# EAGLE design main (EAGLE 9.1.1)
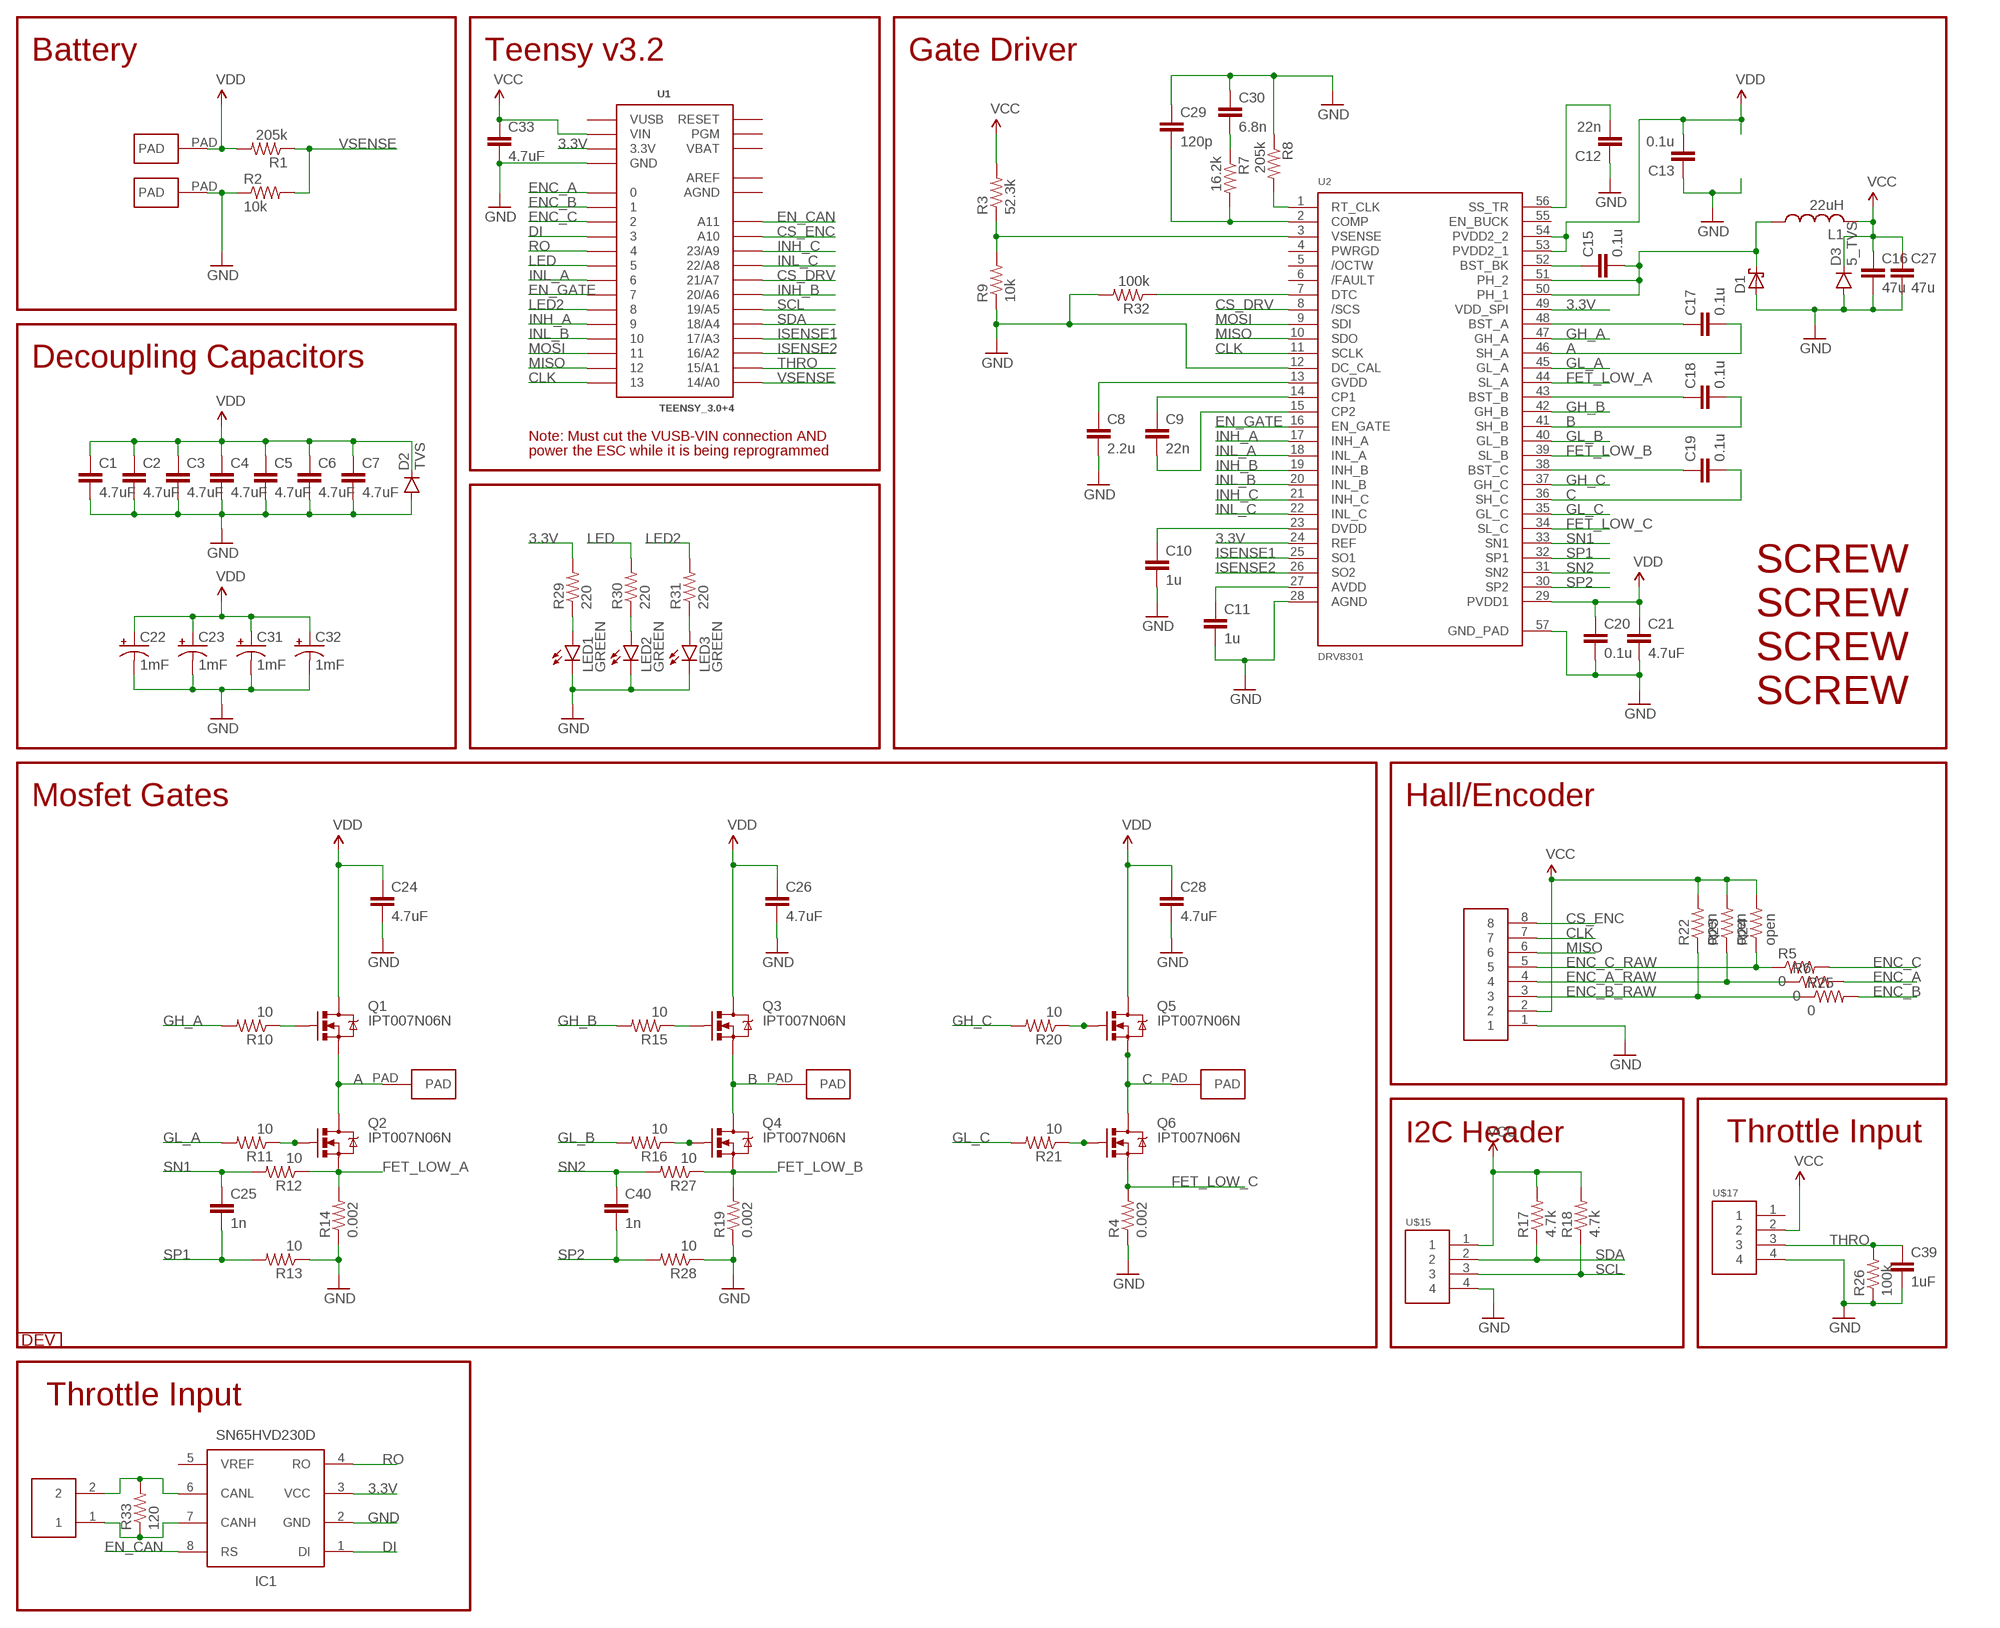
[diagram p0: schematic, sheet 1]

## Parts
C1  4.7uF  CAP1206  [1206]
C2  4.7uF  CAP1206  [1206]
C3  4.7uF  CAP1206  [1206]
C4  4.7uF  CAP1206  [1206]
C5  4.7uF  CAP1206  [1206]
C6  4.7uF  CAP1206  [1206]
C7  4.7uF  CAP1206  [1206]
C8  2.2u  CAP0603-CAP  [0603-CAP]
C9  22n  CAP0603-CAP  [0603-CAP]
C10  1u  CAP0603-CAP  [0603-CAP]
C11  1u  CAP0603-CAP  [0603-CAP]
C12  22n  CAP0603-CAP  [0603-CAP]
C13  0.1u  CAP0603-CAP  [0603-CAP]
C15  0.1u  CAP0603-CAP  [0603-CAP]
C16  47u  CAP0805  [0805]
C17  0.1u  CAP0603-CAP  [0603-CAP]
C18  0.1u  CAP0603-CAP  [0603-CAP]
C19  0.1u  CAP0603-CAP  [0603-CAP]
C20  0.1u  CAP0603-CAP  [0603-CAP]
C21  4.7uF  CAP1206  [1206]
C22  1mF  CAP_POLPTH4  [CPOL-RADIAL-1000UF-25V]
C23  1mF  CAP_POLPTH4  [CPOL-RADIAL-1000UF-25V]
C24  4.7uF  CAP1206  [1206]
C25  1n  CAP0603-CAP  [0603-CAP]
C26  4.7uF  CAP1206  [1206]
C27  47u  CAP0805  [0805]
C28  4.7uF  CAP1206  [1206]
C29  120p  CAP0603-CAP  [0603-CAP]
C30  6.8n  CAP0603-CAP  [0603-CAP]
C31  1mF  CAP_POLPTH4  [CPOL-RADIAL-1000UF-25V]
C32  1mF  CAP_POLPTH4  [CPOL-RADIAL-1000UF-25V]
C33  4.7uF  CAP1206  [1206]
C39  1uF  CAP0603-CAP  [0603-CAP]
C40  1n  CAP0603-CAP  [0603-CAP]
CAN  HEADER2  [2PINVALULOK]
D1  SCHOTTKY_SMA  [SMA]
D2  TVS  DIODEES3J  [SMC]
D3  5_TVS  DIODESOT23  [SOT23-3]
IC1  SN65HVD230D  [SO-8]
L1  22uH  L-USL5650M  [L5650M]
LED1  GREEN  LED1206  [LED-1206]
LED2  GREEN  LED1206  [LED-1206]
LED3  GREEN  LED1206  [LED-1206]
Q1  IPT007N06N  MOSFET-NCHANNELPG-HSOF-8-1  [PG-HSOF-8-1]
Q2  IPT007N06N  MOSFET-NCHANNELPG-HSOF-8-1  [PG-HSOF-8-1]
Q3  IPT007N06N  MOSFET-NCHANNELPG-HSOF-8-1  [PG-HSOF-8-1]
Q4  IPT007N06N  MOSFET-NCHANNELPG-HSOF-8-1  [PG-HSOF-8-1]
Q5  IPT007N06N  MOSFET-NCHANNELPG-HSOF-8-1  [PG-HSOF-8-1]
Q6  IPT007N06N  MOSFET-NCHANNELPG-HSOF-8-1  [PG-HSOF-8-1]
R1  205k  RESISTOR0603-RES  [0603-RES]
R2  10k  RESISTOR0603-RES  [0603-RES]
R3  52.3k  RESISTOR0603-RES  [0603-RES]
R4  0.002  RESISTOR2512  [R2512]
R5  0  RESISTOR0603-RES  [0603-RES]
R6  0  RESISTOR0603-RES  [0603-RES]
R7  16.2k  RESISTOR0603-RES  [0603-RES]
R8  205k  RESISTOR0603-RES  [0603-RES]
R9  10k  RESISTOR0603-RES  [0603-RES]
R10  10  RESISTOR0603-RES  [0603-RES]
R11  10  RESISTOR0603-RES  [0603-RES]
R12  10  RESISTOR0603-RES  [0603-RES]
R13  10  RESISTOR0603-RES  [0603-RES]
R14  0.002  RESISTOR2512  [R2512]
R15  10  RESISTOR0603-RES  [0603-RES]
R16  10  RESISTOR0603-RES  [0603-RES]
R17  4.7k  RESISTOR0603-RES  [0603-RES]
R18  4.7k  RESISTOR0603-RES  [0603-RES]
R19  0.002  RESISTOR2512  [R2512]
R20  10  RESISTOR0603-RES  [0603-RES]
R21  10  RESISTOR0603-RES  [0603-RES]
R22  open  RESISTOR0603-RES  [0603-RES]
R23  open  RESISTOR0603-RES  [0603-RES]
R24  open  RESISTOR0603-RES  [0603-RES]
R25  0  RESISTOR0603-RES  [0603-RES]
R26  100k  RESISTOR0603-RES  [0603-RES]
R27  10  RESISTOR0603-RES  [0603-RES]
R28  10  RESISTOR0603-RES  [0603-RES]
R29  220  RESISTOR0603-RES  [0603-RES]
R30  220  RESISTOR0603-RES  [0603-RES]
R31  220  RESISTOR0603-RES  [0603-RES]
R32  100k  RESISTOR0603-RES  [0603-RES]
R33  120  RESISTOR0603-RES  [0603-RES]
U1  TEENSY_3.0+4  [TEENSY_3.0+4]
U2  DRV8301  [DRV8301]
U$2  HEADER8  [8PINVALULOK]
U$15  HEADER4VALULOK  [4PINVALULOK]
U$16  DEV  [DEV]
U$17  HEADER4VALULOK  [4PINVALULOK]
U$19  SCREW  [M3HOLE]
U$20  SCREW  [M3HOLE]
U$21  SCREW  [M3HOLE]
U$22  SCREW  [M3HOLE]
U$23  PAD  [PAD]
U$24  PAD  [PAD]
U$25  PAD  [PAD]
U$26  PAD  [PAD]
U$27  PAD  [PAD]

## Nets
3.3V: IC1.3(VCC) R29.2 U1.3.3V U1.3.3V1(3.3V) U2.24(REF) U2.49(VDD_SPI)
A: C17.2 Q1.S Q2.D U2.46(SH_A) U$23.PAD
B: C18.2 Q3.S Q4.D U2.41(SH_B) U$24.PAD
C: C19.2 Q5.S Q6.D U2.36(SH_C) U$25.PAD
CANH: CAN.1 IC1.7(CANH) R33.1
CANL: CAN.2 IC1.6(CANL) R33.2
CLK: U1.13 U2.11(SCLK) U$2.7
CS_DRV: U1.21/A7 U2.8(/SCS)
CS_ENC: U1.A10 U$2.8
DI: IC1.1(DI) U1.3
EN_CAN: IC1.8(RS) U1.A11
EN_GATE: U1.7 U2.16(EN_GATE)
ENC_A: R6.2 U1.0
ENC_A_RAW: R6.1 R23.1 U$2.4
ENC_B: R25.2 U1.1
ENC_B_RAW: R22.1 R25.1 U$2.3
ENC_C: R5.2 U1.2
ENC_C_RAW: R5.1 R24.1 U$2.5
FET_LOW_A: Q2.S R12.1 R14.2 U2.44(SL_A)
FET_LOW_B: Q4.S R19.2 R27.1 U2.39(SL_B)
FET_LOW_C: Q6.S R4.2 U2.34(SL_C)
GH_A: R10.2 U2.47(GH_A)
GH_B: R15.2 U2.42(GH_B)
GH_C: R20.2 U2.37(GH_C)
GL_A: R11.2 U2.45(GL_A)
GL_A': Q2.G R11.1
GL_B: R16.2 U2.40(GL_B)
GL_B': Q4.G R16.1
GL_C: R21.2 U2.35(GL_C)
GL_C': Q6.G R21.1
GND: C1.2 C2.2 C3.2 C4.2 C5.2 C6.2 C7.2 C8.2 C10.2 C11.2 C12.1 C13.1 C16.2 C20.2 C21.2 C22.- C23.- C24.2 C26.2 C27.2 C28.2 C29.1 C30.1 C31.- C32.- C33.2 C39.2 D1.A D2.A D3.1(A) IC1.2(GND) LED1.C LED2.C LED3.C R2.1 R4.1 R8.1 R9.1 R13.1 R14.1 R19.1 R26.1 R28.1 R32.2 U1.GND U1.GND1(GND) U2.12(DC_CAL) U2.28(AGND) U2.57(GND_PAD) U$2.1 U$15.4 U$17.4 U$27.PAD
INH_A: U1.9 U2.17(INH_A)
INH_B: U1.20/A6 U2.19(INH_B)
INH_C: U1.23/A9 U2.21(INH_C)
INL_A: U1.6 U2.18(INL_A)
INL_B: U1.10 U2.20(INL_B)
INL_C: U1.22/A8 U2.22(INL_C)
ISENSE1: U1.17/A3 U2.25(SO1)
ISENSE2: U1.16/A2 U2.26(SO2)
LED: R30.2 U1.5
LED2: R31.2 U1.8
MISO: U1.12 U2.10(SDO) U$2.6
MOSI: U1.11 U2.9(SDI)
N$1: Q3.G R15.1
N$2: R3.1 R9.2 U2.3(VSENSE)
N$3: C29.2 R7.2 U2.2(COMP)
N$4: C10.1 U2.23(DVDD)
N$5: Q5.G R20.1
N$6: C12.2 U2.56(SS_TR)
N$7: C30.2 R7.1
N$8: C15.1 U2.52(BST_BK)
N$9: Q1.G R10.1
N$10: R8.2 U2.1(RT_CLK)
N$11: LED1.A R29.1
N$12: R32.1 U2.7(DTC)
N$16: LED2.A R30.1
N$17: LED3.A R31.1
N$28: C19.1 U2.38(BST_C)
N$30: C9.1 U2.14(CP1)
N$31: C11.1 U2.27(AVDD)
N$32: C9.2 U2.15(CP2)
N$33: C8.1 U2.13(GVDD)
N$34: C18.1 U2.43(BST_B)
N$44: C17.1 U2.48(BST_A)
N$47: C15.2 D1.C L1.1 U2.50(PH_1) U2.51(PH_2)
RO: IC1.4(RO) U1.4
SCL: R18.1 U1.19/A5 U$15.3
SDA: R17.1 U1.18/A4 U$15.2
SN1: C25.1 R12.2 U2.33(SN1)
SN2: C40.1 R27.2 U2.31(SN2)
SP1: C25.2 R13.2 U2.32(SP1)
SP2: C40.2 R28.2 U2.30(SP2)
THRO: C39.1 R26.2 U1.15/A1 U$17.3
VCC: C16.1 C27.1 C33.1 D3.3(C) L1.2 R3.2 R17.2 R18.2 R22.2 R23.2 R24.2 U1.VIN U$2.2 U$15.1 U$17.2
VDD: C1.1 C2.1 C3.1 C4.1 C5.1 C6.1 C7.1 C13.2 C20.1 C21.1 C22.+ C23.+ C24.1 C26.1 C28.1 C31.+ C32.+ D2.C Q1.D Q3.D Q5.D R1.2 U2.29(PVDD1) U2.53(PVDD2_1) U2.54(PVDD2_2) U$26.PAD
VSENSE: R1.1 R2.2 U1.14/A0
Unconnected: IC1.5(VREF) U1.PGM U1.RESET U2.4(PWRGD) U2.5(/OCTW) U2.6(/FAULT) U2.55(EN_BUCK) U$17.1

## Notes on the sheet
- Battery | Teensy v3.2 | Gate Driver
- Decoupling Capacitors
- Note: Must cut the VUSB-VIN connection AND
- power the ESC while it is being reprogrammed
- Mosfet Gates | Hall/Encoder
- I2C Header | Throttle Input
- Throttle Input

## Power pins joined to a net without a drawn wire
AGND: U1.AGND
AREF: U1.AREF
VBAT: U1.VBAT
VUSB: U1.VUSB

## Library data of the parts
C1-C7 C10 C11 C16 C21 C24 C26-C28 C33 = SparkFun-Capacitors:CAP: Capacitor Standard 0603 ceramic capacitor, and 0.1" leaded capacitor.
C8 C9 C12 C13 C15 C17-C20 C25 C29 C30 C39 C40 = SparkFun-Passives:CAP: Capacitor Standard 0603 ceramic capacitor, and 0.1" leaded capacitor.
C22 C23 C31 C32 = SparkFun-Capacitors:CAP_POL: Capacitor Polarized These are standard SMD and PTH capacitors. Normally 10uF, 47uF, and 100uF in electrolytic and tantalum varieties. Always verify the external diameter of the through hole cap, it varies with capacity, voltage, and manufacturer. The EIA devices should be standard.
CAN = Custom_old:HEADER2
D1 = sc_usercreated:SCHOTTKY_SMA
D2 = SparkFun-DiscreteSemi:DIODE: Diode These are standard reverse protection diodes and small signal diodes. SMA package can handle up to about 1A. SOD-323 can handle about 200mA. What the SOD-323 package when ordering, there are some mfgs out there that are 5-pin packages.; PROD_ID: DIO-12441; VALUE: 3A/600V
D3 = SparkFun-DiscreteSemi:DIODE: Diode These are standard reverse protection diodes and small signal diodes. SMA package can handle up to about 1A. SOD-323 can handle about 200mA. What the SOD-323 package when ordering, there are some mfgs out there that are 5-pin packages.
IC1 = Misaka-IC:SN65HVD23*D: 3.3V CAN Bus Transceiver Supply voltage: 3...3.6V Max rate: 1Mbps Standby mode(SN65HVD230D) Sleep mode(SN65HVD231D) Slope control mode
L1 = rcl:L-US: INDUCTOR, American symbol; SPICEPREFIX: L
LED1-LED3 = SparkFun-LED:LED: LEDs Standard schematic elements and footprints for 5mm, 3mm, 1206, and 0603 sized LEDs. 5mm - Spark Fun Electronics SKU : COM-00529 (and others)
Q1-Q6 = Custom_old:MOSFET-NCHANNEL: Generic NMOS footprint
R1-R3 R5-R13 R15-R18 R20-R33 = SparkFun-Passives:RESISTOR: Resistor Basic schematic elements and footprints for 0603, 1206, and PTH resistors.
R4 R14 R19 = SparkFun-Resistors:RESISTOR: Resistor Basic schematic elements and footprints for 0603, 1206, and PTH resistors.
U1 = Teensy3.0:TEENSY_3.0+4: Teensy 3.0 board, showing all pins that are easily acessible. See 'AllAnalogPins" and 'AllPins' packages for additional pin holes, as needed. The 'Basic' package has fewer pins.
U2 = F-J:DRV8301
U$2 = Custom_old:HEADER8
U$15 U$17 = Custom_old:HEADER4
U$16 = F-J:DEV
U$19-U$22 = Custom_old:SCREW
U$23-U$27 = Custom_old:PAD

## Board
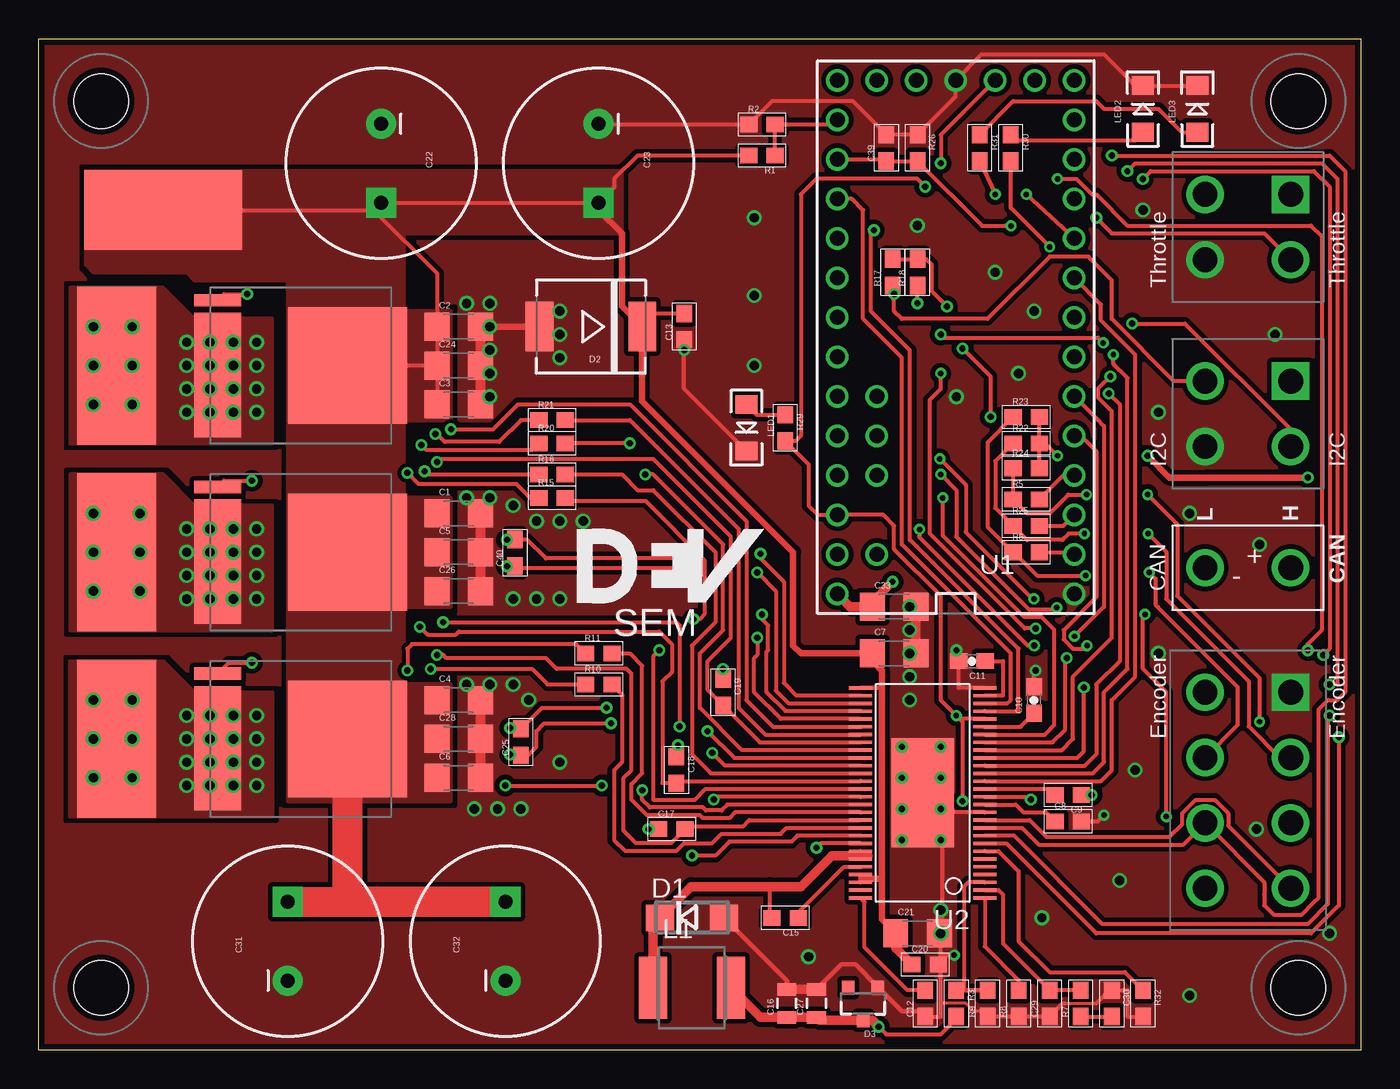
[diagram p1: board, top side]
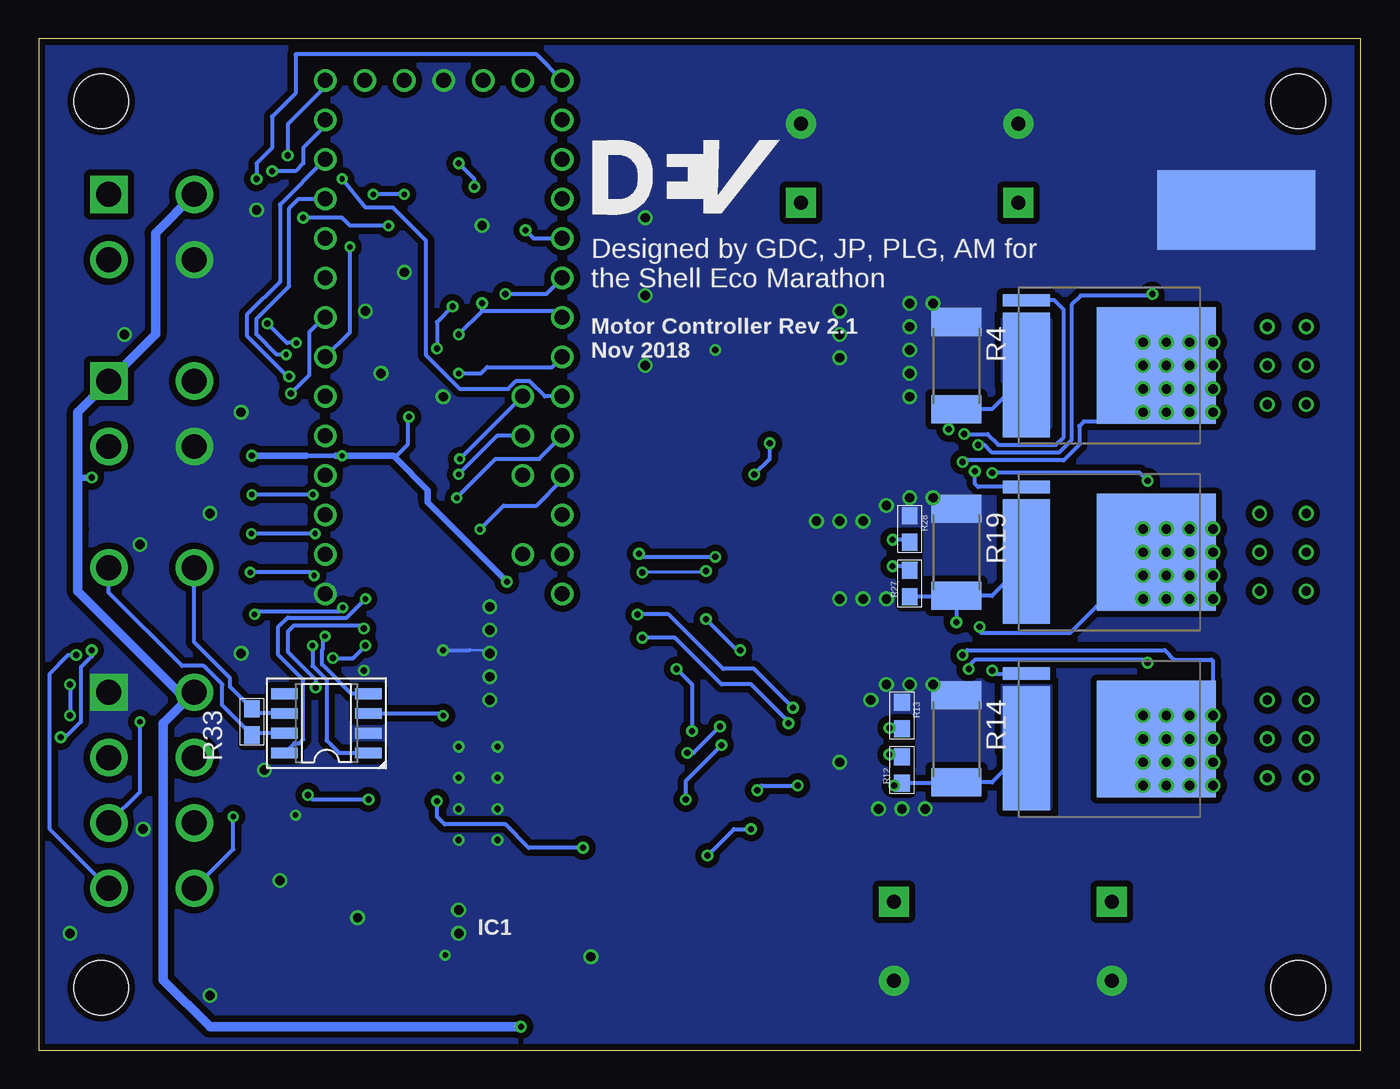
[diagram p2: board, bottom side, seen from below]

Size 85 x 65 mm. Coordinates in mm from the lower left corner, seen from the top.
Outline: 0,0 0,65 85,65 85,0 0,0
Copper layers (1*16): Top 0.0356mm / dielectric 1.5011mm / Bottom 0.0356mm
Design rules "patrick *": minimum track width 6mil, minimum drill 13mil, track to track 6mil, track to pad 6mil, pad to pad 6mil, via to via 6mil, smd to smd 6mil, copper to edge 15mil, drill to drill 6mil, minimum pad ring 7mil, minimum via ring 7mil, stop-mask expansion 3mil, vias tented up to drill 30mil, thermal gap 10mil

### Footprints (pad centres in the part's own frame; a part is rotated, then mirrored left to right if it is on the bottom)
1206 = smd 1.6 x 1.8: 1 -1.4,0; 2 1.4,0
0603-CAP = smd 1.1 x 1: 1 -0.85,0; 2 0.85,0
0805 = smd 0.8 x 1.2: 1 -0.9,0; 2 0.9,0
CPOL-RADIAL-1000UF-25V = drill 0.9 pad 1.93 square: + 2.54,0 | drill 0.9 pad 1.93: - -2.54,0
2PINVALULOK = drill 1.6: 1 0,5.5; 2 0,0
SMA = smd 1.8 x 1.7: A 2.05,0; C -2.05,0
SMC = smd 1.778 x 3.175: A 3.302,0; C -3.302,0
SOT23-3 = smd 0.8 x 0.9: 1 -0.95,-1; 2 0.95,-1; 3 0,1.1
SO-8 = smd 1.7 x 0.7: 1 -2.7,1.905; 2 -2.7,0.635; 3 -2.7,-0.635; 4 -2.7,-1.905; 5 2.7,-1.905; 6 2.7,-0.635; 7 2.7,0.635; 8 2.7,1.905
L5650M = smd 1.8 x 4: 1 -2.5,0; 2 2.5,0
LED-1206 = smd 1.2 x 1.4: A -1.5,0; C 1.5,0
PG-HSOF-8-1 = smd 7.5 x 7.65: D 0,8.855 | smd 0.8 x 3: G -4.2,0.5 | smd 8 x 3: S 0.6,0.5
0603-RES = smd 1.1 x 1: 1 -0.85,0; 2 0.85,0
R2512 = smd 1.8 x 3.2: 1 -2.8,0; 2 2.8,0
TEENSY_3.0+4 = drill 0.965: 0 -7.62,13.97; 1 -7.62,11.43; 2 -7.62,8.89; 3 -7.62,6.35; 3.3V 7.62,11.43; 3.3V1 -2.54,-16.51; 4 -7.62,3.81; 5 -7.62,1.27; 6 -7.62,-1.27; 7 -7.62,-3.81; 8 -7.62,-6.35; 9 -7.62,-8.89; 10 -7.62,-11.43; 11 -7.62,-13.97; 12 -7.62,-16.51; 13 7.62,-16.51; 14/A0 7.62,-13.97; 15/A1 7.62,-11.43; 16/A2 7.62,-8.89; 17/A3 7.62,-6.35; 18/A4 7.62,-3.81; 19/A5 7.62,-1.27; 20/A6 7.62,1.27; 21/A7 7.62,3.81; 22/A8 7.62,6.35; 23/A9 7.62,8.89; A10 5.08,6.35; A11 5.08,3.81; AGND 7.62,13.97; AREF 5.08,8.89; GND -7.62,16.51; GND1 0,-16.51; PGM 2.54,-16.51; RESET 5.08,-16.51; VBAT -5.08,-16.51; VIN 7.62,16.51; VUSB 5.08,13.97
DRV8301 = smd 1.5 x 0.21: 1 -4,6.75; 2 -4,6.25; 3 -4,5.75; 4 -4,5.25; 5 -4,4.75; 6 -4,4.25; 7 -4,3.75; 8 -4,3.25; 9 -4,2.75; 10 -4,2.25; 11 -4,1.75; 12 -4,1.25; 13 -4,0.75; 14 -4,0.25; 15 -4,-0.25; 16 -4,-0.75; 17 -4,-1.25; 18 -4,-1.75; 19 -4,-2.25; 20 -4,-2.75; 21 -4,-3.25; 22 -4,-3.75; 23 -4,-4.25; 24 -4,-4.75; 25 -4,-5.25; 26 -4,-5.75; 27 -4,-6.25; 28 -4,-6.75; 29 4,-6.75; 30 4,-6.25; 31 4,-5.75; 32 4,-5.25; 33 4,-4.75; 34 4,-4.25; 35 4,-3.75; 36 4,-3.25; 37 4,-2.75; 38 4,-2.25; 39 4,-1.75; 40 4,-1.25; 41 4,-0.75; 42 4,-0.25; 43 4,0.25; 44 4,0.75; 45 4,1.25; 46 4,1.75; 47 4,2.25; 48 4,2.75; 49 4,3.25; 50 4,3.75; 51 4,4.25; 52 4,4.75; 53 4,5.25; 54 4,5.75; 55 4,6.25; 56 4,6.75 | smd 4 x 7: 57 0,0
8PINVALULOK = drill 1.6 square: 1 0,5.5 | drill 1.6: 2 0,0; 3 4.2,5.5; 4 4.2,0; 5 8.4,5.5; 6 8.4,0; 7 12.6,5.5; 8 12.6,0
4PINVALULOK = drill 1.6 square: 1 0,5.5 | drill 1.6: 2 0,0; 3 4.2,5.5; 4 4.2,0
M3HOLE = hole 3.5: 0,0
PAD = smd 10.16 x 5.08: PAD 0,0

### Placement (x,y rotation side)
C1  27,34.5 0 top
C2  27,46.5 0 top
C3  27,41.5 0 top
C4  27,22.5 0 top
C5  27,32 0 top
C6  27,17.5 0 top
C7  55,25.5 0 top
C8  66.2,14.7 0 top
C9  66.2,16.4 180 top
C10  64,22.5 90 top
C11  60,25 180 top
C12  57,3 90 top
C13  41.5,46.5 90 top
C15  48,8.5 180 top
C16  48.1,3 90 top
C17  40.7,14.2 0 top
C18  41,18 270 top
C19  44,23 270 top
C20  57,5.5 0 top
C21  56.5,7.5 0 top
C22  22,57 270 top
C23  36,57 270 top
C24  27,44 0 top
C25  31,19.8 90 top
C26  27,29.5 0 top
C27  50,3 90 top
C28  27,20 0 top
C29  65,3 90 top
C30  69,3 270 top
C31  16,7 90 top
C32  30,7 90 top
C33  55,28.5 0 top
C39  54.5,58 90 top
C40  30.62,31.97 90 top
CAN  75,31 270 top
D1  42,8.5 0 top
D2  35.5,46.5 180 top
D3  53,3 180 top
IC1  66.5,21 180 bottom
L1  42,4 0 top
LED1  45.5,40 270 top
LED2  71,60.5 90 top
LED3  74.5,60.5 90 top
Q1  11,20 270 top
Q2  22,20 270 bottom
Q3  11,32 270 top
Q4  22,32 270 bottom
Q5  11,44 270 top
Q6  22,44 270 bottom
R1  46.5,57.5 180 top
R2  46.5,59.5 0 top
R3  59,3 270 top
R4  26,44 270 bottom
R5  63.5,35.4 0 top
R6  63.5,32 0 top
R7  67,3 90 top
R8  63,3 90 top
R9  61,3 90 top
R10  36,23.5 0 top
R11  36,25.5 0 top
R12  29.5,18 90 bottom
R13  29.5,21.5 270 bottom
R14  26,20 270 bottom
R15  33,35.5 0 top
R16  33,37 0 top
R17  54.9,50 90 top
R18  56.5,50 90 top
R19  26,32 270 bottom
R20  33,39 0 top
R21  33,40.5 0 top
R22  63.5,39 0 top
R23  63.5,40.7 0 top
R24  63.5,37.4 0 top
R25  63.5,33.7 0 top
R26  56.5,58 270 top
R27  29,30 90 bottom
R28  29,33.5 270 bottom
R29  48,40 270 top
R30  62.5,58 270 top
R31  60.5,58 270 top
R32  71,3 270 top
R33  71.3,21.1 90 bottom
U1  58.96,45.83 180 top
U2  56.83,16.53 180 top
U$2  75,23 270 top
U$15  75,43 270 top
U$16  34.65,28.74 0 top
U$17  75,55 270 top
U$19  4,4 0 top
U$20  81,4 0 top
U$21  4,61 0 top
U$22  81,61 0 top
U$23  5,20 90 top
U$24  5,32 90 top
U$25  5,44 90 top
U$26  8,54 0 top
U$27  8,54 0 bottom
U$28  DEV  [DEV]  49.35,53.74 0 bottom

### Tracks (layer width: path | path; a pad name or v marks a point on that pad's centre or on a via)
3.3V  (via drill 0.35, 0.4)
  Top 0.254: U2.24 60.81,21.3 59.2,21.3 | 59.2,21.3 v59,21.5 58,22.5 58,29.2 55,32.2 55,33.7 54.3,34.4 U1.3.3V 50.1,34.4 49.5,35 49.5,37.65 R29.2 48.65,39.15 49,39.5 49,55 50,56 56.5,56 v57,55.5 | 59.2,21.3 59.4,21.1 v59.4,16 | U2.49 50.28,13.28 v50,13 | U1.3.3V1 58,58.84 v58,57
  Bottom 0.254: v50,13 53.5,13 55,14.5 58.9,14.5 59.4,15 v59.4,16 | v58,57 57,56 v57,55.5 | IC1.3 59.13,21.64 | 59.13,21.64 | 59.13,21.64 v59,21.5
A  (via drill 0.4, 0.6)
  Top 0.254: U2.46 45.68,14.78 45.3,14.4 41.75,14.4 C17.2 40.65,13.3 38.4,13.3 37.6,14.1 37.6,17.5 38.1,18 38.1,24.2 37.8,24.5 33.3,24.5 32.6,25.2 26.2,25.2 26,25.4 v25.6,25.4
  Bottom 0.254: v25.6,25.4 25.3,25.7 12.6,25.7 12,25.1 9.6,25.1 9.5,25 v9.5,21.5 | v12.5,20 Q2.D
  other vias: 9.5,20 9.5,18.5 9.5,17 11,17 11,18.5 11,20 11,21.5 12.5,21.5 12.5,18.5 12.5,17 14,17 14,18.5 14,20 14,21.5 3.5,20 6,20 6,17.5 3.5,17.5 3.5,22.5 6,22.5
  pour Top (isolate 0.254, no thermals): 2,15 2,25 8,25 10,23 15,23 15,15
B  (via drill 0.4, 0.6)
  Top 0.254: U2.41 41.35,17.28 41.22,17.15 C18.2 40.1,17.15 40.1,23.7 40.7,24.3 40.7,26.1 39.9,26.9 27,26.9 26.8,26.7 25,26.7 v24.5,27.2
  Bottom 0.254: v14,29 14.5,28.5 17,28.5 18.7,26.8 24.4,26.8 24.5,26.9 v24.5,27.2 | v12.5,32 Q4.D
  other vias: 9.5,33.5 9.5,32 9.5,30.5 9.5,29 11,29 11,30.5 11,32 11,33.5 12.5,33.5 12.5,30.5 12.5,29 14,30.5 14,32 14,33.5 3.5,34.5 3.5,32 3.5,29.5 6.5,29.5 6.5,32 6.5,34.5
  pour Top (isolate 0.254, no thermals): 2,37 2,27 15,27 15,35 10,35 8,37
C  (via drill 0.4, 0.6)
  Top 0.254: U2.36 46.37,19.78 C19.2 43,23.15 43,25 44.5,26.5 44.5,33 39.5,38 25.8,38 v25.6,37.8
  Bottom 0.254: v14,44 14,43.2 16.8,40.4 17.8,40.4 18.1,40.1 18.1,38.9 19.1,37.9 25.4,37.9 25.5,37.8 v25.6,37.8 | v12.5,44 Q6.D
  other vias: 9.5,45.5 9.5,44 9.5,42.5 9.5,41 11,41 11,42.5 11,44 11,45.5 12.5,45.5 12.5,42.5 14,42.5 14,41 12.5,41 14,45.5 3.5,44 6,44 6,46.5 3.5,46.5 3.5,41.5 6,41.5
  pour Top (isolate 0.254, no thermals): 2,49 2,39 15,39 15,47 10,47 8,49
CANH
  Bottom 0.254: IC1.7 71.19,20.36 R33.1 73.2,22.15 73.2,23.5 74.4,24.7 75.8,24.7 80.5,29.4 CAN.1
CANL
  Bottom 0.254: IC1.6 70.98,21.64 R33.2 72.7,23.35 72.7,23.9 75,26.2 CAN.2
CLK  (via drill 0.4)
  Top 0.254: v71,56 71.5,56.5 82,56.5 83,55.5 83,25.8 v82.6,25.4 | U2.11 63.72,14.78 64.8,13.7 72.7,13.7 73.52,14.52 73.52,15.21 74.39,16.08 75.61,16.08 76.48,15.21 76.48,14.42 U$2.7
  Bottom 0.254: U1.13 53,64 68.5,64 68.5,61.5 70,60 70,58 71,57 v71,56 | U$2.7 84.3,14.2 84.3,24.2 83.1,25.4 v82.6,25.4
CS_DRV  (via drill 0.35, 0.4)
  Top 0.254: U2.8 62.22,13.28 68,7.5 81.8,7.5 83.6,9.3 v83.6,20.1 | v65.5,56 66.72,56 67.72,55 68,55 70,53 81.8,53 82.5,52.3 82.5,27 81.6,26.1 v81.6,25.7
  Bottom 0.254: U1.21/A7 52.46,42.02 53.47,43.02 54.3,43.02 54.82,42.5 57.93,42.5 60.1,44.67 60.1,52.03 62.23,54.16 63.98,54.16 v65.5,56 | v81.6,25.7 81.6,25.3 82.3,24.6 82.3,21.1 83.3,20.1 v83.6,20.1
CS_ENC  (via drill 0.35)
  Top 0.254: v58,37 59,36 59,33 63.7,28.3 65.33,28.3 v65.46,28.43 | v72.5,15 72.5,23 71,24.5 71,27.87 v71.13,28
  Bottom 0.254: U1.A10 55.52,39.48 v58,37 | U$2.8 72.5,12.9 v72.5,15 | v71.13,28 70.93,28.21 65.67,28.21 65.46,28.42 v65.46,28.43
DI  (via drill 0.35)
  Top 0.254: U1.3 67.02,39.48 68,38.5 68,29.1 65.9,27 65.9,26.4 66.5,25.8 67.2,25.8 v67.4,26
  Bottom 0.254: v67.4,26 67.4,24.7 66.5,23.8 66.5,19.9 65.69,19.09 IC1.1
EN_CAN  (via drill 0.35)
  Top 0.254: v57.93,38 59.6,36.33 59.6,33.3 63.9,29 v64,29
  Bottom 0.254: U1.A11 57.9,38 v57.93,38 | IC1.8 68.56,19.74 68.23,19.74 68,19.97 68,23.8 69.6,25.4 69.6,27.2 69,27.8 65.2,27.8 v64,29
EN_GATE
  Top 0.254: U2.16 68.28,17.28 69,18 69,22.5 70.5,24 70.5,44.7 68.3,46.9 68.3,47.92 U1.7
ENC_A
  Top 0.254: R6.2 66.44,32 U1.0
ENC_A_RAW  (via drill 0.35)
  Top 0.254: R23.1 61,39.05 61,33.65 R6.1 62.7,32 64.2,30.5 v67.3,30.5 | U$2.4 77.09,20.89 77.09,23.33 71.96,28.46 71.8,28.62 71.8,30.3 v71.4,30.7
  Bottom 0.254: v71.4,30.7 67.5,30.7 v67.3,30.5
ENC_B
  Top 0.254: R25.2 65.88,33.7 U1.1
ENC_B_RAW  (via drill 0.35)
  Top 0.254: R22.1 61.5,37.85 61.5,34.85 | 61.5,34.85 R25.1 | U$2.3 79.8,18.8 77.8,20.8 77.8,23.7 72.5,29 72.5,32.03 v71.33,33.2 | 61.5,34.85 63.55,32.8 65.83,32.8 66.23,33.2 v67.23,33.2
  Bottom 0.254: v67.23,33.2 v71.33,33.2
ENC_C
  Top 0.254: R5.2 65.89,36.94 U1.2
ENC_C_RAW  (via drill 0.35)
  Top 0.254: R24.1 62.65,36.5 R5.1 63.55,34.5 65,34.5 66.2,35.7 v67.37,35.7 | v78.5,21.1 78.5,23.9 73.2,29.2 73.2,33.8 v71.3,35.7
  Bottom 0.254: U$2.5 78.5,16.6 v78.5,21.1 | v67.37,35.7 v71.3,35.7
FET_LOW_A  (via drill 0.4)
  Top 0.254: U2.44 44.28,15.78 43.9,15.4 42.9,15.4 42.7,15.6 39.3,15.6 38.8,16.1 v38.8,16.7 | v30,17 v36.2,17
  Bottom 0.254: v38.8,16.7 38.5,17 v36.2,17 | Q2.S 23.7,17.2 R14.2 26.05,17.15 R12.1 29.65,17 v30,17
  pour Bottom (isolate 0.254, no thermals): 20,23.5 20,15.5 23,19.5 23,23.5
FET_LOW_B  (via drill 0.4)
  Top 0.254: U2.39 44.12,18.28 v43.3,19.1 | v26,27.5 41,27.5 41.2,27.3 v41.2,20.8
  Bottom 0.254: v43.3,19.1 42.9,19.1 v41.2,20.8 | R19.2 v26,27.5 | Q4.S 23.7,29.2 R19.2 | R19.2 26.05,29.15 R27.1
FET_LOW_C  (via drill 0.4)
  Top 0.254: v26.5,39.9 29.2,39.9 30.8,41.5 38,41.5 45.5,34 45.5,22.5 47.22,20.78 U2.34
  Bottom 0.254: Q6.S 23.7,41.2 R4.2 26.5,40.7 v26.5,39.9
  pour Bottom (isolate 0.254, no thermals): 20,47 20,40 23,43 23,47
GH_A
  Top 0.254: R10.2 37.5,22.85 37.5,18.5 37,18 37,13.5 37.7,12.8 41,12.8 41.5,13.3 43.3,13.3 43.9,13.9 47.7,13.9 48.08,14.28 U2.47
GH_B  (via drill 0.4)
  Top 0.254: R15.2 34.05,35.3 39,35.3 42.8,31.5 42.8,28 42.5,27.7 v42.1,27.7 | v39.9,25.7 39.5,25.3 39.5,16.1 42.2,16.1 42.88,16.78 U2.42
  Bottom 0.254: v42.1,27.7 40.1,25.7 v39.9,25.7
GH_C  (via drill 0.4)
  Top 0.254: U2.37 45.22,19.28 42.5,22 42.5,25.5 44,27 44,32.5 39.5,37 v39,37 | v38,39 R20.2
  Bottom 0.254: v39,37 38,38 v38,39
GL_A
  Top 0.254: U2.45 44.78,15.28 44.4,14.9 42.7,14.9 42.5,15.1 39.1,15.1 38.1,16.1 38.1,17.1 38.8,17.8 38.8,24.7 38,25.5 R11.2
GL_A'  (via drill 0.4)
  Top 0.254: R11.1 34.55,26.1 24,26.1 23.7,25.8 v23.7,24.4
  Bottom 0.254: v23.7,24.4 23.5,24.2 Q2.G
GL_B
  Top 0.254: R16.2 37.5,37 38.5,36 39.5,36 43.5,32 43.5,27.5 42,26 42,19 43.22,17.78 U2.40
GL_B'  (via drill 0.4)
  Top 0.254: v24.8,37.2 25,37 R16.1
  Bottom 0.254: Q4.G 24.6,36.2 24.8,36.4 v24.8,37.2
GL_C
  Top 0.254: R21.2 38,40.5 45,33.5 45,22 46.72,20.28 U2.35
GL_C'  (via drill 0.4)
  Top 0.254: R21.1 31,40.5 29.6,39.1 26.1,39.1 25.6,39.6 v25.5,39.6
  Bottom 0.254: v25.5,39.6 24,39.6 23.3,38.9 19.6,38.9 19.1,39.4 19.1,47.6 19.7,48.2 Q6.G
GND  (via drill 0.35, 0.4, 0.6)
  Top 0.2: 66,3 68,3 | R9.1 60.65,2.5 60.1,2.5 59.6,3 58,3
  Top 0.254: U2.12 58.22,15.28 | 58.22,15.28 58.08,15.28 | 58.08,15.28 U2.57 | 58.08,15.28 58.08,7.68 C21.2 | C12.1 58,2.15 58,3 58,5.5 | 58,5.5 58,6 | 58,6 58,7 57.9,7 C21.2 | LED3.C LED2.C 70.5,62 68.5,64 60.62,64 U1.GND1 58.96,61.31 R26.1 C39.2 52.35,61 47.15,61 R2.1 36.04,59.5 C23.- | C10.2 64,24.3 v64.1,24.4 | U2.28 59.15,23.28 C11.2 59,25 v59,25.7 | R9.1 R8.1 C29.1 65.85,3 66,3 | R32.2 70,2.15 70,3.85 C30.1 68.85,3.85 68,3 | C20.2 58,5.5 | C13.1 v41.5,45 41.5,42.5 LED1.C | v58,15.5 58.22,15.28 | C8.2 68.1,14.7 v68.5,15.1 | 58,6 58.1,6.1 v58.87,6.1 | C21.2 58,7.6 v58,9
  Top 0.305: D1.A 48.1,4.45 C16.2 | C27.2 51.6,5.5 52.5,5.5 53.95,4.05 D3.1 54,4 55.5,2.5 56.65,2.5 C12.1
  Top 0.406: C2.2 v29,46.5 D2.A
  Top 0.61: C16.2 C27.2 | C4.2 C28.2 C6.2 | C1.2 C5.2 C26.2 | C2.2 C24.2 C3.2 | C33.2 C7.2
  Bottom 0.152: 57.3,25.7 56.2,25.7 v56,25.5
  Bottom 0.254: v59,25.7 57.3,25.7
  other vias: 29,48 29,45 29,43.5 29,42 27.5,48 55.5,19.5 55.5,17.5 55.5,15.5 55.5,13.5 58,13.5 58,17.5 58,19.5 63,43.5 59,42 61.5,50 56.5,53 27.5,23.5 29,23.5 30.5,23.5 31.5,22.5 33.5,18.5 31,15.5 29.5,15.5 28,15.5 27.5,35.5 29,35.5 30.5,35 32,34 33.5,34 35,34 33.5,47.5 33.5,46 33.5,44.5 30.5,29 32,29 33.5,29 56,28.5 56,27 56,24 56,22.5 64.5,8.5 83,7.5 69.5,10.9 74,3.5 78.3,14.2 70.5,18 72,25.5 78.5,32.5 74,34.5 64,47.5 72,41 71,54 79.5,46 46,53.5 46,48.5 46,44 49.5,6 58,7.5
  pour Bottom (isolate 0.406, rank 6, no thermals): -0.5,65.5 -0.5,-0.5 85.5,-0.5 85.5,65.5
  pour Top (isolate 0.305, rank 3, no thermals): -0.5,-0.5 85.5,-0.5 85.5,65.5 -0.5,65.5
INH_A  (via drill 0.35)
  Top 0.254: U2.17 67.78,17.78 68.5,18.5 68.5,23 70,24.5 70,43.2 69.1,44.1 v69.1,44.7
  Bottom 0.254: v69.1,44.7 69.7,44.7 71,46 71,47 68.9,49.1 68.9,54.1 68.28,54.72 U1.9
INH_B  (via drill 0.35, 0.4)
  Top 0.254: U2.19 66.78,18.78 67.2,19.2 v67.2,23.3 | v64.1,27.1 63.4,27.1 57.3,33.2 57.3,41.8 58,42.5 v58,43.5
  Bottom 0.254: v58,43.5 56.58,43.5 56.17,43.91 51.99,43.91 U1.20/A6 | v64.1,27.1 64.3,27.3 68.6,27.3 69,26.9 69,25.6 67.2,23.8 v67.2,23.3
INH_C  (via drill 0.35, 0.4)
  Top 0.254: U2.21 65.18,19.78 66,20.6 66,25.1 v66.1,25.2 | v64,26 63.6,26 56.6,33 56.63,33 v56.63,33.47
  Bottom 0.254: v66.1,25.2 64.8,25.2 v64,26 | v56.63,33.47 55.11,35 53,35 51.34,36.66 U1.23/A9
INL_A  (via drill 0.4)
  Top 0.254: U2.18 67.28,18.28 68,19 68,23.5 69.5,25 69.5,41.5 v68.8,42.2
  Bottom 0.254: v68.8,42.2 67.6,43.4 67.6,46.16 66.66,47.1 U1.6
INL_B  (via drill 0.4)
  Top 0.254: U2.20 65.78,19.28 66.5,20 66.5,24 69,26.5 69,41.07 68.14,41.93 68.14,42.54 v68.9,43.3
  Bottom 0.254: U1.10 69.5,54.34 69.5,49.4 71.6,47.3 71.6,45.87 69.03,43.3 v68.9,43.3
INL_C  (via drill 0.35)
  Top 0.254: U2.22 64.68,20.28 65.3,20.9 65.3,27.02 64.5,27.82 63.38,27.82 58.13,33.07 v58.13,35.5
  Bottom 0.254: v58.13,35.5 55.63,38 52.82,38 U1.22/A8
ISENSE1  (via drill 0.4)
  Top 0.254: U2.25 63,21.78 63,25.8 56,32.8 56,45 53.5,47.5 53.5,52.5 v53.7,52.7
  Bottom 0.254: v53.7,52.7 53.18,52.18 U1.17/A3
ISENSE2
  Top 0.254: U2.26 62.28,22.28 62.5,22.5 62.5,25.5 55.5,32.5 55.5,44.5 53,47 53,54 52.28,54.72 U1.16/A2
LED  (via drill 0.35)
  Top 0.254: v65,51.63 62.5,54.13 R30.2
  Bottom 0.254: U1.5 65,46.14 65,46.5 v65,51.63
LED2  (via drill 0.35)
  Top 0.254: R31.2 v61.5,55 | v63.5,55 U1.8
  Bottom 0.254: v61.5,55 v63.5,55
MISO  (via drill 0.4)
  Top 0.254: v69,57.5 83,57.5 84,56.5 84,23 83.5,22.5 82.9,22.5 82.3,21.9 82.3,12.3 | U2.10 63.22,14.28 64.3,13.2 73.6,13.2 U$2.6 78.8,10.8 78.8,10 | 78.8,10 | 78.8,10 | 78.8,10 78.8,9.3 79.4,8.7 81.2,8.7 82,9.5 82.3,9.8 82.3,12.3 | 82.3,12.3
  Bottom 0.254: U1.12 66.58,61.92 69,59.5 v69,57.5
MOSI  (via drill 0.4)
  Top 0.254: v70,56.5 70.5,57 82.5,57 83.5,56 83.5,23.5 v83,23.5 | U2.9 62.72,13.78 68.4,8.1 81.6,8.1 82.9,9.4 82.9,21.4 v83,21.5
  Bottom 0.254: U1.11 66.58,59.42 68,58 68,57 68.5,56.5 v70,56.5 | v83,23.5 v83,21.5
N$1  (via drill 0.4)
  Top 0.254: Q3.G 11.9,36.6 v13.7,36.6 | v23.7,37.1 24.4,36.4 30.7,36.4 31.6,35.5 R15.1
  Bottom 0.254: v13.7,36.6 14.2,37.1 v23.7,37.1
N$2
  Top 0.254: U2.3 59.78,10.78 59.5,10.5 59.5,3.85
  Top 0.305: R3.1 59.5,3.85 R9.2
N$3
  Top 0.254: R7.2 C29.2 62,6.85 62,10 61.72,10.28 U2.2
N$4
  Top 0.254: U2.23 63.13,20.78 C10.1
N$5  (via drill 0.4)
  Top 0.254: Q5.G 11.9,48.6 v13.4,48.6 | v24.6,38.9 24.9,38.6 31.75,38.6 R20.1
  Bottom 0.254: v13.4,48.6 13.5,48.5 18,48.5 18.6,47.9 18.6,39.2 19.4,38.4 23.7,38.4 24.2,38.9 v24.6,38.9
N$6
  Top 0.254: C12.2 55.85,3.85 53.1,6.6 53.1,9.51 U2.56
N$7
  Top 0.254: R7.1 C30.2
N$8
  Top 0.254: C15.1 48.85,8.85 51.78,11.78 U2.52
N$9  (via drill 0.4)
  Top 0.254: Q1.G 12.2,24.9 v13.7,24.9 | v25.2,24.5 31.7,24.5 32.7,23.5 R10.1
  Bottom 0.254: v13.7,24.9 13.9,25.1 24.8,25.1 25.2,24.7 v25.2,24.5
N$10
  Top 0.254: U2.1 60.83,6.67 63,4.5 R8.2
N$11
  Top 0.254: LED1.A 46.15,40.85 R29.1
N$12
  Top 0.254: U2.7 61.72,12.78 63,11.5 63,7 65,5 69.85,5 R32.1
N$16
  Top 0.254: R30.1 62.85,58.5 70.5,58.5 LED2.A
N$17
  Top 0.254: R31.1 62.65,61 68,61 68.5,60.5 72,60.5 73.5,59 LED3.A
N$28  (via drill 0.4)
  Top 0.254: C19.1 v44,24.5 | v43,20.5 44.72,18.78 U2.38
  Bottom 0.254: v44,24.5 43,23.5 v43,20.5
N$30  (via drill 0.4)
  Top 0.254: U2.14 63.62,16.28 v63.8,16.1 | C9.1 v67.7,16.4
  Bottom 0.254: v63.8,16.1 67.4,16.1 v67.7,16.4
N$31
  Top 0.254: C11.1 62,25 62,22.78 U2.27
N$32
  Top 0.254: U2.15 64.97,16.78 C9.2
N$33
  Top 0.254: U2.13 62.82,15.78 63.3,15.3 64.75,15.3 C8.1
N$34  (via drill 0.4)
  Top 0.254: C18.1 41.1,18.95 v41.1,19.6 | U2.43 43.58,16.28 v43.4,16.1
  Bottom 0.254: v43.4,16.1 43.4,17.3 v41.1,19.6
N$44  (via drill 0.4)
  Top 0.254: U2.48 48.78,13.78 48.4,13.4 44.4,13.4 43.5,12.5 v42,12.5 | v39.2,14.2 C17.1
  Bottom 0.254: v42,12.5 40.3,14.2 v39.2,14.2
N$47
  Top 0.254: 53.3,12.5 53.08,12.28 U2.51 | C15.2 47,8.65 47,10.5
  Top 0.305: U2.50 U2.51
  Top 0.61: L1.1 39.5,8.05 D1.C 41.95,10.5 47,10.5 49,10.5 51,12.5 53.3,12.5
RO  (via drill 0.35)
  Top 0.254: U1.4 68,40.6 68.5,40.1 68.5,28.49 v66.6,26.6
  Bottom 0.254: IC1.4 64.91,22.91 66.79,24.79 66.79,25.71 66.77,25.74 66.77,26.43 v66.6,26.6
SCL  (via drill 0.35, 0.4)
  Top 0.254: v56.5,48 R18.1 | v58,46 58.2,45.8 68.11,45.8 v68.45,45.45 | v70.3,46.7 73.7,46.7 80.5,39.9 U$15.3
  Bottom 0.254: U1.19/A5 51.74,47.5 56.5,47.5 | 56.5,47.5 v56.5,48 | 56.5,47.5 v58,46 | v68.45,45.45 69.05,45.45 v70.3,46.7
SDA  (via drill 0.4)
  Top 0.254: R17.1 54.9,48.7 v55,48.6 55,47.5 55.5,47 61,47 65,51 67.5,51 69,49.5 69,47 73,43 U$15.2
  Bottom 0.254: U1.18/A4 52.38,48.6 v55,48.6
SN1  (via drill 0.4)
  Top 0.254: v30.3,19 30.35,18.95 C25.1 31.45,18.95 32,19.5 32,20.5 32.5,21 v36.8,21 | U2.33 47.72,21.28 46,23 46,25.2 46.2,25.4 v46.2,26.5
  Bottom 0.254: R12.2 29.65,19 v30.3,19 | v36.8,21 36.8,21.1 39.2,23.5 41.1,23.5 44.1,26.5 v46.2,26.5
SN2  (via drill 0.4)
  Top 0.254: v30.1,31.1 30.12,31.12 C40.1 30.74,31 42,31 42.1,30.9 v42.1,30.8 | v46.2,30.7 47.4,29.5 47.4,23.1 48.22,22.28 U2.31
  Bottom 0.2: v42.1,30.8 42.2,30.7 v46.2,30.7
  Bottom 0.254: R27.2 29.25,31.1 v30.1,31.1
SP1  (via drill 0.4)
  Top 0.254: v30.3,20.7 30.35,20.65 C25.2 32.35,22 v36.5,22 | U2.32 52.81,21.8 48,21.8 46.8,23 46.8,25.6 46.9,25.7 46.9,27.3 46.5,27.7 v46.5,28
  Bottom 0.254: R13.2 29.55,20.7 v30.3,20.7 | v36.5,22 39,24.5 41,24.5 44.5,28 v46.5,28
SP2  (via drill 0.4)
  Top 0.254: v30.1,32.8 30.12,32.82 C40.2 31.38,32.82 32.6,31.6 41.6,31.6 v41.5,31.7 | U2.30 48.72,22.78 47.9,23.6 47.9,30.1 46.4,31.6 v46.4,31.9
  Bottom 0.254: R28.2 29.15,32.8 v30.1,32.8 | v46.4,31.9 46.2,31.7 v41.5,31.7
THRO  (via drill 0.35, 0.4)
  Top 0.254: U1.15/A1 54.5,57.26 C39.1 R26.2 60.67,52.98 v62.52,52.98 | U$17.3 78.8,52.5 69,52.5 v68,53.5
  Bottom 0.254: v68,53.5 65.5,53.5 65,53 62.54,53 v62.52,52.98
VCC  (via drill 0.35, 0.4)
  Top 0.254: v54,1.5 54.5,1 58,1 59,2 R3.2 | R17.2 R18.2 57.05,50.85 57.4,50.5 57.4,48.8 v58.4,47.8 | v59.4,45.1 61.2,43.3 v61.2,40.7 | R24.2 R22.2 | R22.2 R23.2 | R22.2 64.7,39 v65.5,38.2
  Top 0.406: v71.3,38.2 72.7,36.8 75.1,36.8 v81.6,36.8
  Top 0.61: L1.2 46.4,2.1 C16.1 C27.1 50.2,1.9 D3.3 53.6,1.9 v54,1.5 | U1.VIN 52.16,28.5 C33.1 53.6,28.8 v54.9,30.1
  Bottom 0.254: 62,38 62,38.2 61.3,38.9 61.3,40.6 v61.2,40.7 | v58.4,47.8 59.4,46.8 v59.4,45.1
  Bottom 0.305: 65.9,38.2 67.8,38.2
  Bottom 0.406: v54.9,30.1 60,35.2 60,36 62,38 62.2,38.2 v65.5,38.2 65.9,38.2 | 67.8,38.2 v71.3,38.2 | 82.5,36.7 82.6,36.8 v81.6,36.8
  Bottom 0.61: v54,1.5 74,1.5 77,4.5 77,15 77,21 U$2.2 76,23 82.5,29.5 82.5,33.5 82.5,36.7 82.5,41 U$15.1 77.5,46 77.5,52.5 U$17.2
VDD
  Top 0.254: C24.1 C2.1 25.6,49.94 21.54,54 | C24.1 Q5.D | C24.1 C3.1 | U$26.PAD 21.54,54 | 21.54,54 C22.+ C23.+ 37,55.46 37,56 38.5,57.5 R1.2 | D2.C 39.65,47.35 C13.2
  Top 0.305: U2.54 U2.53 53.11,11 | 54.2,23.28 U2.29
  Top 0.406: 54.2,11 54.2,23.28 54.2,24.4 54,24.6 C7.1 49,25.5 48.5,26 48.5,32 38.8,41.7 D2.C 37.5,47.8 37.5,52.5 36,54 C23.+ | 53.11,11 54.2,11 | C21.1 54.2,8.4 54.2,11
  Top 0.61: C20.1 55.1,6.55 C21.1
  Top 1.93: C31.+ C32.+ 19.86,9.54 Q1.D
  pour Top (isolate 0.254, no thermals): 3,56.5 3,50.5 3.5,50 9.5,50 10,49.5 16,49.5 16,16 26.5,16 26.5,23.5 23.5,23.5 23.5,28.5 26.5,28.5 26.5,35.5 23.5,35.5 23.5,40.5 26.5,40.5 26.5,47.5 23.5,47.5 23.5,52.5 37.5,52.5 37.5,56.5
VSENSE
  Top 0.254: U1.14/A0 51.34,59.5 R2.2 R1.1

### Text on the board
tPlace: Throttle | Throttle | I2C | I2C | L | H | CAN | SEM | Encoder | Encoder
bPlace: Designed by GDC, JP, PLG, AM for / the Shell Eco Marathon | Motor Controller Rev 2.1 / Nov 2018